# Altium schematic sheet blinkenbytes_sch_altium design.schdoc
size 561 x 373 mm
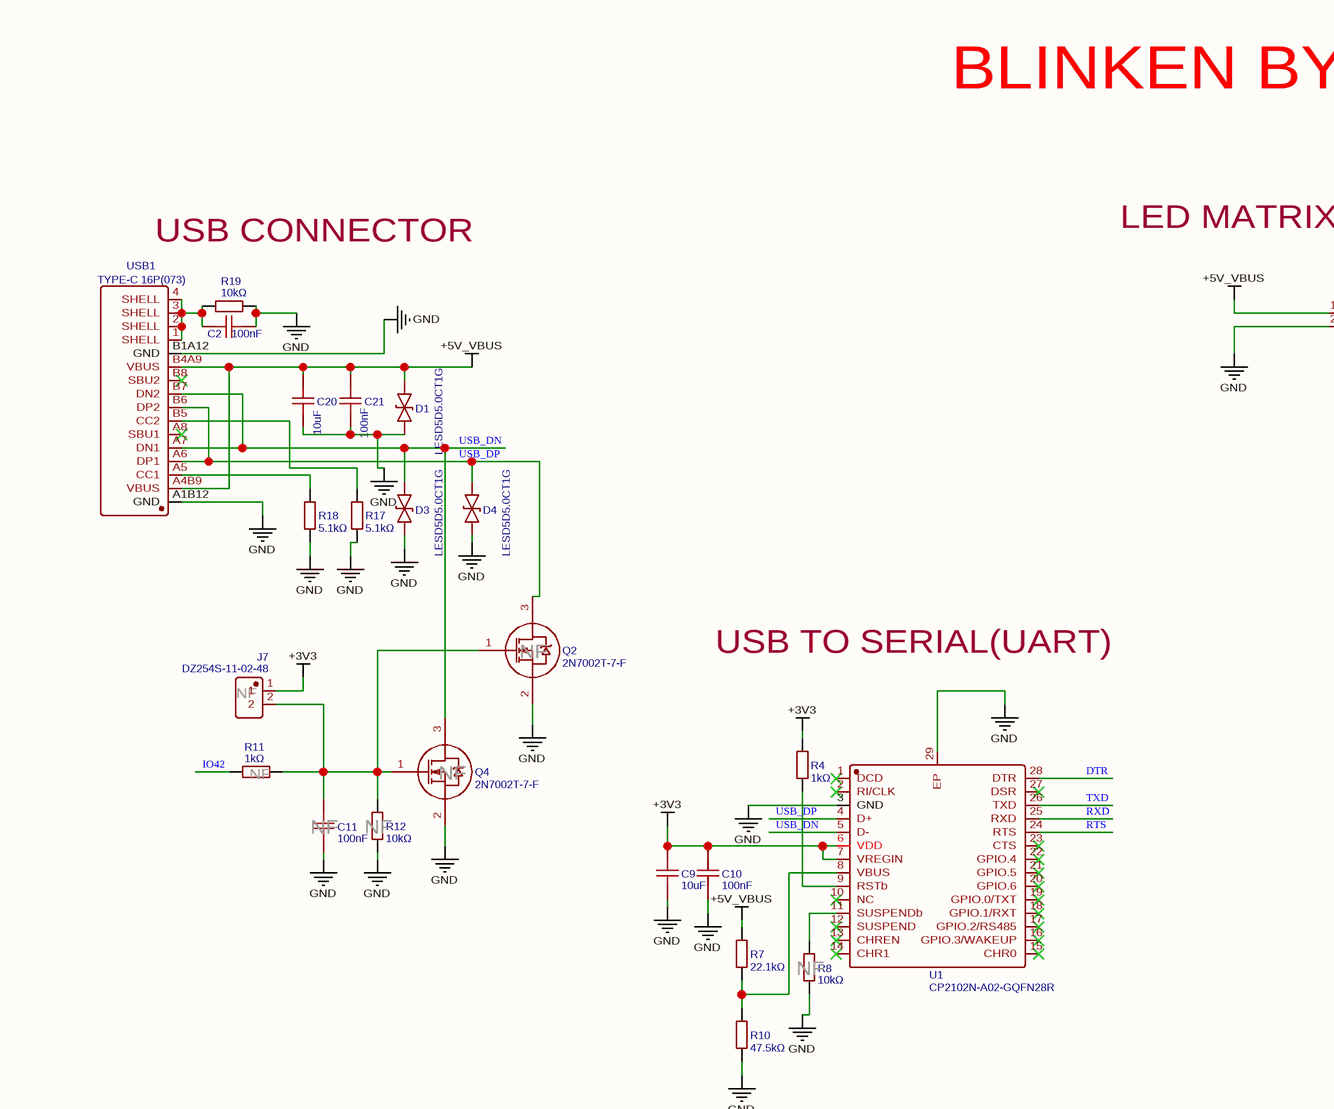
[diagram p0: blinkenbytes_sch_altium design.schdoc, top left]
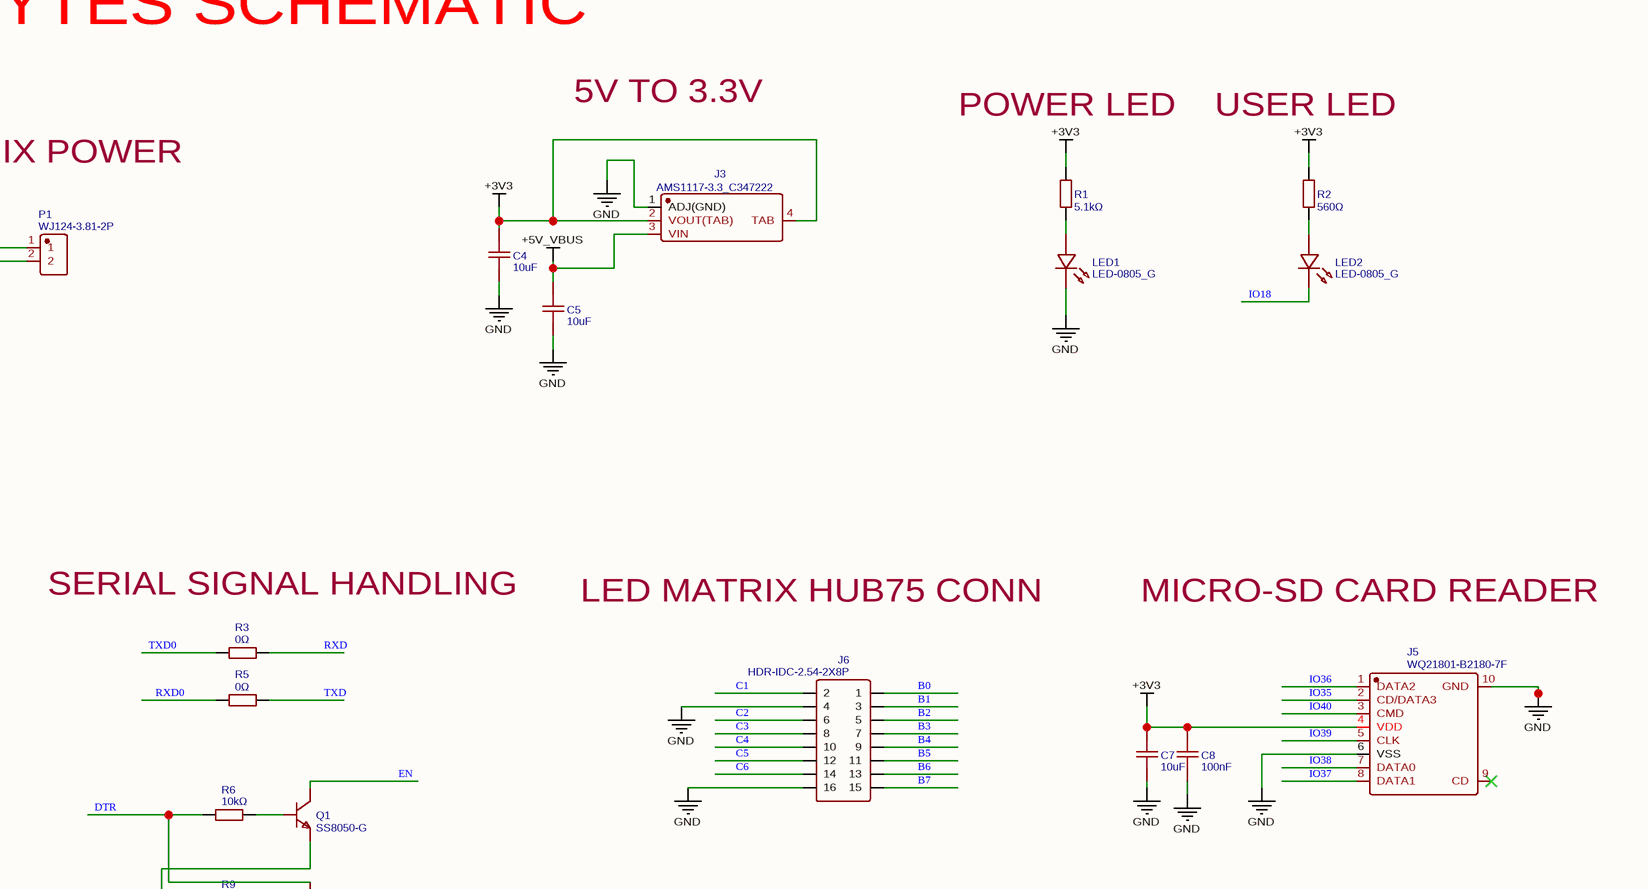
[diagram p1: blinkenbytes_sch_altium design.schdoc, top right]
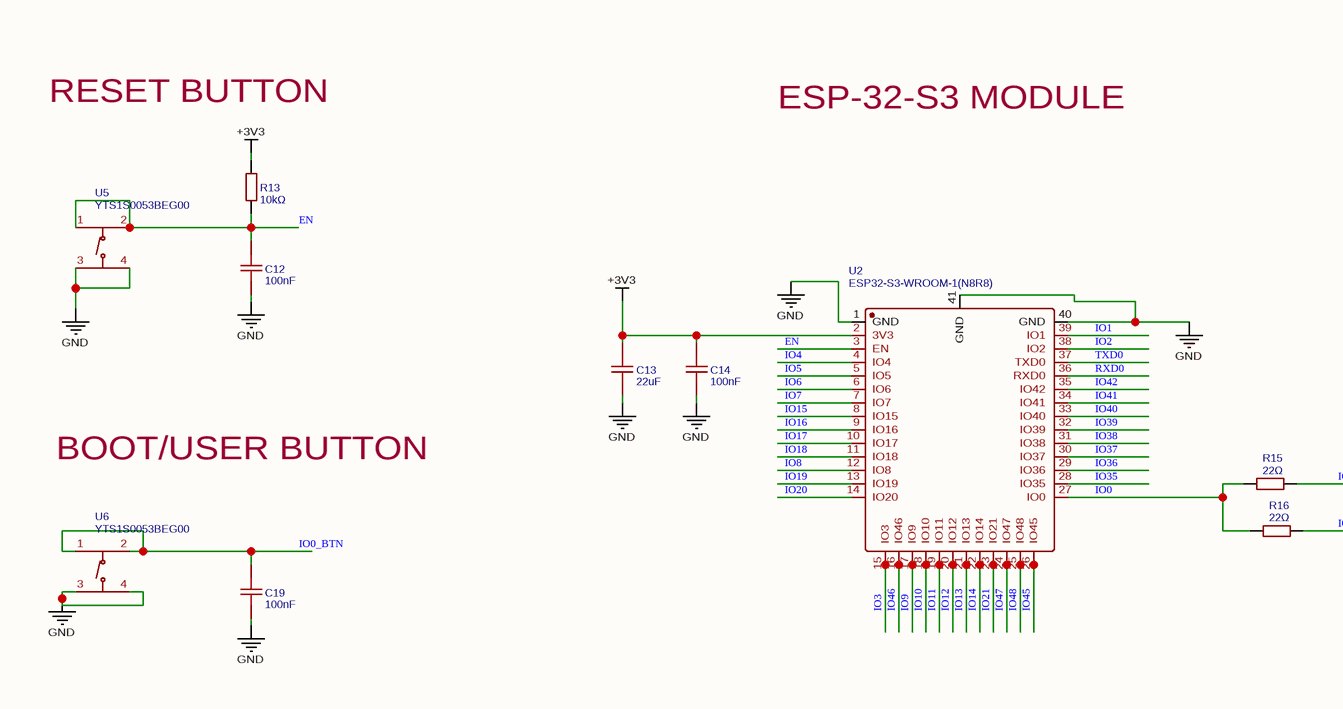
[diagram p2: blinkenbytes_sch_altium design.schdoc, bottom left]
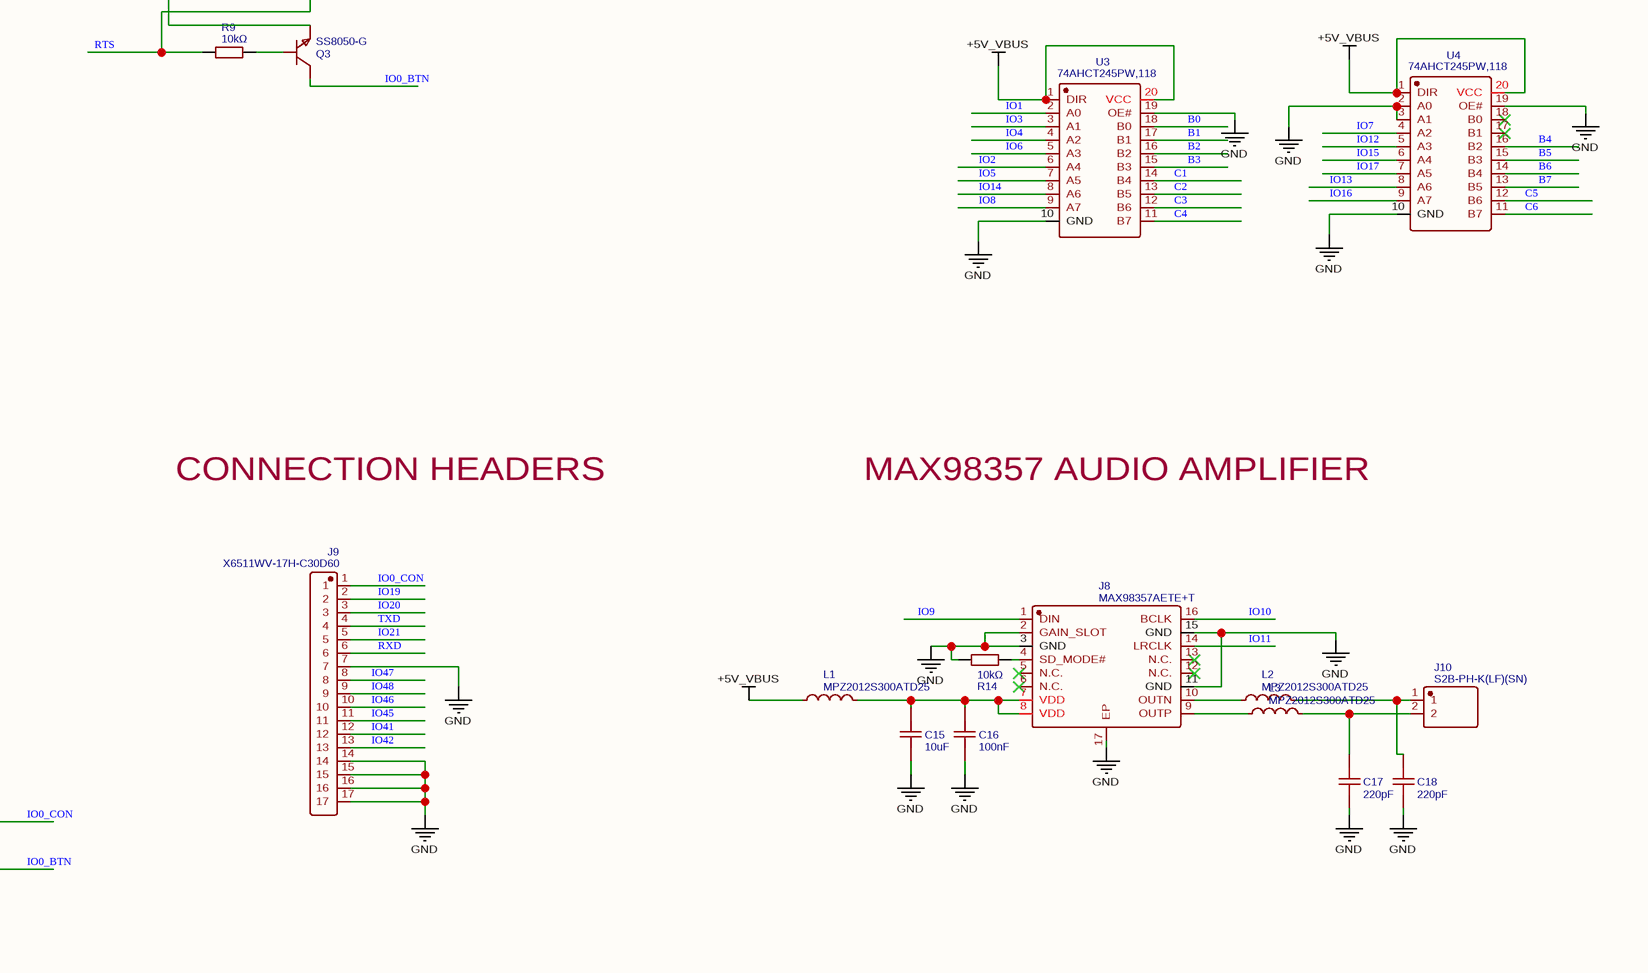
[diagram p3: blinkenbytes_sch_altium design.schdoc, bottom right]

## Parts
C2  100nF  [C0805]
C4  10uF  [C0402]
C5  10uF  [C0402]
C7  10uF  [C0402]
C8  100nF  [C0402]
C9  10uF  [C0402]
C10  100nF  [C0402]
C11  100nF  [C0402]
C12  100nF  [C0402]
C13  22uF  [C0805]
C14  100nF  [C0402]
C15  10uF  [C0805]
C16  100nF  [C0805]
C17  220pF  [C0402]
C18  220pF  [C0402]
C19  100nF  [C0402]
C20  10uF  [C0805]
C21  100nF  [C0805]
D1  LESD5D5.0CT1G  [SOD-523_L1.2-W0.8-LS1.6-BI]
D3  LESD5D5.0CT1G  [SOD-523_L1.2-W0.8-LS1.6-BI]
D4  LESD5D5.0CT1G  [SOD-523_L1.2-W0.8-LS1.6-BI]
J3  AMS1117-3.3_C347222  [SOT-223-4_L6.5-W3.5-P2.30-LS7.0-BR]
J5  WQ21801-B2180-7F  [TF-SMD_WQ21801-B2180-7F]
J6  HDR-IDC-2.54-2X8P  [IDC-TH_16P-P2.54_C3406]
J7  DZ254S-11-02-48  [HDR-SMD_2P-P2.54_XKB_X6511WVS-02H-C60D48R2]
J8  MAX98357AETE+T  [TQFN-16_L3.0-W3.0-P0.50-BL-EP1.5]
J9  X6511WV-17H-C30D60  [HDR-TH_17P-P2.54-V-M]
J10  S2B-PH-K(LF)(SN)  [CONN-TH_S2B-PH-K-LF-SN]
L1  MPZ2012S300ATD25  [L0805]
L2  MPZ2012S300ATD25  [L0805]
L3  MPZ2012S300ATD25  [L0805]
LED1  LED-0805_G  [LED0805_GREEN]
LED2  LED-0805_G  [LED0805_GREEN]
P1  WJ124-3.81-2P  [CONN-TH_2P-P3.81_KF124-3.81-2P]
Q1  SS8050-G  [SOT-23-3_L2.9-W1.3-P1.90-LS2.4-BR]
Q2  2N7002T-7-F  [SOT-523-3_L1.6-W0.8-P1.00-LS1.6-BR]
Q3  SS8050-G  [SOT-23-3_L2.9-W1.3-P1.90-LS2.4-BR]
Q4  2N7002T-7-F  [SOT-523-3_L1.6-W0.8-P1.00-LS1.6-BR]
R1  5.1kΩ  [R0402]
R2  560Ω  [R0402]
R3  0Ω  [R0402]
R4  1kΩ  [R0402]
R5  0Ω  [R0402]
R6  10kΩ  [R0402]
R7  22.1kΩ  [R0402]
R8  10kΩ  [R0402]
R9  10kΩ  [R0402]
R10  47.5kΩ  [R0402]
R11  1kΩ  [R0402]
R12  10kΩ  [R0402]
R13  10kΩ  [R0402]
R14  10kΩ  [R0402]
R15  22Ω  [R0402]
R16  22Ω  [R0402]
R17  5.1kΩ  [R0402]
R18  5.1kΩ  [R0402]
R19  10kΩ  [R0603]
U1  CP2102N-A02-GQFN28R  [QFN-28_L5.0-W5.0-P0.50-TL-EP3.3]
U2  ESP32-S3-WROOM-1(N8R8)  [WIRELM-SMD_ESP32-S3-WROOM-1]
U3  74AHCT245PW,118  [TSSOP-20_L6.5-W4.4-P0.65-LS6.4-BL]
U4  74AHCT245PW,118  [TSSOP-20_L6.5-W4.4-P0.65-LS6.4-BL]
U5  YTS1S0053BEG00  [KEY-SMD_4P-L6.4-W6.3-P4.00-LS9.5]
U6  YTS1S0053BEG00  [KEY-SMD_4P-L6.4-W6.3-P4.00-LS9.5]
USB1  TYPE-C 16P(073)  [USB-C-SMD_TYPE-C16PIN_C668624]

## Nets
+3V3: C4.2 C7.2 C8.2 C9.2 C10.2 C13.2 C14.2 J3.2(VOUT(TAB)) J3.4(TAB) J5.4(VDD) J7.1 R1.2 R2.2 R4.2 R13.2 U1.6(VDD) U1.7(VREGIN) U2.2(3V3)
+5V_VBUS: C5.2 C20.2 C21.2 D1.1 J3.3(VIN) L1.1 P1.1 R7.2 U3.1(DIR) U3.20(VCC) U4.1(DIR) U4.20(VCC) USB1.A4B9(VBUS) USB1.B4A9(VBUS)
GND: C2.2 C4.1 C5.1 C7.1 C8.1 C9.1 C10.1 C11.1 C12.1 C13.1 C14.1 C15.1 C16.1 C17.1 C18.1 C19.1 C20.1 C21.1 D1.2 D3.2 D4.2 J3.1(ADJ(GND)) J5.6(VSS) J5.10(GND) J6.4 J6.16 J8.2(GAIN_SLOT) J8.3(GND) J8.11(GND) J8.15(GND) J8.17(EP) J9.7 J9.14 J9.15 J9.16 J9.17 LED1.2 P1.2 Q2.2(S) Q4.2(S) R8.2 R10.1 R12.2 R14.1 R17.1 R18.1 R19.2 U1.3(GND) U1.29(EP) U2.1(GND) U2.40(GND) U2.41(GND) U3.10(GND) U3.19(OE#) U4.2(A0) U4.3(A1) U4.10(GND) U4.19(OE#) U5.3(C) U5.4(D) U6.3(C) U6.4(D) USB1.A1B12(GND) USB1.B1A12(GND)
B0: J6.1 U3.18(B0)
B1: J6.3 U3.17(B1)
B2: J6.5 U3.16(B2)
B3: J6.7 U3.15(B3)
B4: J6.9 U4.16(B2)
B5: J6.11 U4.15(B3)
B6: J6.13 U4.14(B4)
B7: J6.15 U4.13(B5)
C1: J6.2 U3.14(B4)
C2: J6.6 U3.13(B5)
C3: J6.8 U3.12(B6)
C4: J6.10 U3.11(B7)
C5: J6.12 U4.12(B6)
C6: J6.14 U4.11(B7)
DTR: Q3.2(E) R6.1 U1.28(DTR)
EN: C12.2 Q1.3(C) R13.1 U2.3(EN) U5.1(A) U5.2(B)
IO0: R15.1 R16.1 U2.27(IO0)
IO0_BTN: C19.2 Q3.3(C) R16.2 U6.1(A) U6.2(B)
IO0_CON: J9.1 R15.2
IO1: U2.39(IO1) U3.2(A0)
IO2: U2.38(IO2) U3.6(A4)
IO3: U2.15(IO3) U3.3(A1)
IO4: U2.4(IO4) U3.4(A2)
IO5: U2.5(IO5) U3.7(A5)
IO6: U2.6(IO6) U3.5(A3)
IO7: U2.7(IO7) U4.4(A2)
IO8: U2.12(IO8) U3.9(A7)
IO9: J8.1(DIN) U2.17(IO9)
IO10: J8.16(BCLK) U2.18(IO10)
IO11: J8.14(LRCLK) U2.19(IO11)
IO12: U2.20(IO12) U4.5(A3)
IO13: U2.21(IO13) U4.8(A6)
IO14: U2.22(IO14) U3.8(A6)
IO15: U2.8(IO15) U4.6(A4)
IO16: U2.9(IO16) U4.9(A7)
IO17: U2.10(IO17) U4.7(A5)
IO18: LED2.2 U2.11(IO18)
IO19: J9.2 U2.13(IO19)
IO20: J9.3 U2.14(IO20)
IO21: J9.5 U2.23(IO21)
IO35: J5.2(CD/DATA3) U2.28(IO35)
IO36: J5.1(DATA2) U2.29(IO36)
IO37: J5.8(DATA1) U2.30(IO37)
IO38: J5.7(DATA0) U2.31(IO38)
IO39: J5.5(CLK) U2.32(IO39)
IO40: J5.3(CMD) U2.33(IO40)
IO41: J9.12 U2.34(IO41)
IO42: J9.13 R11.2 U2.35(IO42)
IO45: J9.11 U2.26(IO45)
IO46: J9.10 U2.16(IO46)
IO47: J9.8 U2.24(IO47)
IO48: J9.9 U2.25(IO48)
RTS: Q1.2(E) R9.1 U1.24(RTS)
RXD: J9.6 R3.2 U1.25(RXD)
RXD0: R5.1 U2.36(RXD0)
TXD: J9.4 R5.2 U1.26(TXD)
TXD0: R3.1 U2.37(TXD0)
USB_DN: D3.1 Q4.3(D) U1.5(D-) USB1.A7(DN1) USB1.B7(DN2)
USB_DP: D4.1 Q2.3(D) U1.4(D+) USB1.A6(DP1) USB1.B6(DP2)
NetC2_1: C2.1 R19.1 USB1.1(SHELL) USB1.2(SHELL) USB1.3(SHELL) USB1.4(SHELL)
NetC11_2: C11.2 J7.2 Q2.1(G) Q4.1(G) R11.1 R12.1
NetC15_2: C15.2 C16.2 J8.7(VDD) J8.8(VDD) L1.2
NetC17_2: C17.2 J10.2 L3.2
NetC18_2: C18.2 J10.1 L2.2
NetJ8_4: J8.4(SD_MODE#) R14.2
NetJ8_9: J8.9(OUTP) L3.1
NetJ8_10: J8.10(OUTN) L2.1
NetLED1_1: LED1.1 R1.1
NetLED2_1: LED2.1 R2.1
NetQ1_1: Q1.1(B) R6.2
NetQ3_1: Q3.1(B) R9.2
NetR4_1: R4.1 U1.9(RSTb)
NetR7_1: R7.1 R10.2 U1.8(VBUS)
NetR8_1: R8.1 U1.11(SUSPENDb)
NetR17_2: R17.2 USB1.B5(CC2)
NetR18_2: R18.2 USB1.A5(CC1)

Not connected (* = marked no-connect by the designer): J5 9(CD)*; J8 5(N.C.)* 6(N.C.)* 12(N.C.)* 13(N.C.)*; U1 1(DCD)* 2(RI/CLK)* 10(NC)* 12(SUSPEND)* 13(CHREN)* 14(CHR1)* 15(CHR0)* 16(GPIO.3/WAKEUP)* 17(GPIO.2/RS485)* 18(GPIO.1/RXT)* 19(GPIO.0/TXT)* 20(GPIO.6)* 21(GPIO.5)* 22(GPIO.4)* 23(CTS)* 27(DSR)*; U4 17(B1)* 18(B0)*; USB1 A8(SBU1)* B8(SBU2)*

## Notes on the sheet
- BLINKEN BYTES SCHEMATIC
- 5V TO 3.3V
- LED MATRIX POWER
- POWER LED
- USER LED
- USB CONNECTOR
- (near J7) NF
- (near Q2) NF
- USB TO SERIAL(UART)
- (near R3) SERIAL SIGNAL HANDLING
- LED MATRIX HUB75 CONN
- MICRO-SD CARD READER
- (near R11) NF
- (near Q4) NF
- (near C11) NF
- (near R12) NF
- (near R8) NF
- RESET BUTTON
- ESP-32-S3 MODULE
- CONNECTION HEADERS
- MAX98357 AUDIO AMPLIFIER
- BOOT/USER BUTTON

## Library data of the parts
C2 C16 C21 = 100nF: Manufacturer: SAMSUNG(三星); Manufacturer Part: CL21B104KBFWPJE; nameAlias: Value; Contributor: lcsc; Supplier: LCSC; Supplier Part: C6766050; JLCPCB Part Class: Extended Part; spicePre: C; spiceSymbolName: CL21B104KBFWPJE
C4 C5 C7 C9 = 10uF: Manufacturer: SAMSUNG(三星); Manufacturer Part: CL05A106MP5NUNC; nameAlias: Value; Contributor: LCSC; Supplier: LCSC; Supplier Part: C315248; JLCPCB Part Class: Extended Part; spicePre: C; spiceSymbolName: CL05A106MP5NUNC_C315248
C8 C10-C12 C14 C19 = 100nF: Manufacturer Part: CL05B104KO5NNNC; Manufacturer: SAMSUNG(三星); nameAlias: Value; Supplier: LCSC; Supplier Part: C1525; JLCPCB Part Class: Basic Part; spicePre: C; spiceSymbolName: CL05B104KO5NNNC
C13 = 22uF: Manufacturer: SAMSUNG(三星); Manufacturer Part: CL21A226MAQNNNE; nameAlias: Value; Supplier: LCSC; Supplier Part: C45783; JLCPCB Part Class: Basic Part; spicePre: C; spiceSymbolName: CL21A226MAQNNNE
C15 C20 = 10uF: Manufacturer: SAMSUNG(三星); Manufacturer Part: CL21B106KAYQNNE; nameAlias: Value; Contributor: lcsc; Supplier: LCSC; Supplier Part: C3039694; JLCPCB Part Class: Extended Part; spicePre: C; spiceSymbolName: CL21B106KAYQNNE
C17 C18 = 220pF: Manufacturer: Kyocera AVX; Manufacturer Part: 04025A221JAT2A; nameAlias: Value; Contributor: LCSC; Supplier: LCSC; Supplier Part: C597026; JLCPCB Part Class: Extended Part; spicePre: C; spiceSymbolName: 04025A221JAT2A
D1 D3 D4 = LESD5D5.0CT1G: Manufacturer: LRC(乐山无线电); Contributor: LCSC; Supplier: LCSC; Supplier Part: C383211; Manufacturer Part: LESD5D5.0CT1G; JLCPCB Part Class: Extended Part; spicePre: D; spiceSymbolName: LESD5D5.0CT1G
J3 = AMS1117-3.3_C347222: Manufacturer: UMW(友台半导体); Contributor: LCSC; Supplier: LCSC; Supplier Part: C347222; Manufacturer Part: AMS1117-3.3; JLCPCB Part Class: Extended Part; spicePre: U; spiceSymbolName: AMS1117-3.3_C347222
J5 = WQ21801-B2180-7F: Manufacturer: FOXCONN(富士康); Contributor: LCSC; Supplier: LCSC; Supplier Part: C2836427; Manufacturer Part: WQ21801-B2180-7F; spicePre: C; spiceSymbolName: WQ21801-B2180-7F
J6 = HDR-IDC-2.54-2X8P: Manufacturer: BOOMELE(博穆精密); Manufacturer Part: 2.54-2*8P简牛; Supplier: LCSC; Supplier Part: C3406; JLCPCB Part Class: Extended Part; spicePre: P; spiceSymbolName: HDR-IDC-2.54-2X8P
J7 = DZ254S-11-02-48: Manufacturer: DEALON(德艺隆); Contributor: lcsc; Supplier: LCSC; Supplier Part: C5160785; Manufacturer Part: DZ254S-11-02-48; JLCPCB Part Class: Extended Part; spicePre: C; spiceSymbolName: DZ254S-11-02-48
J8 = MAX98357AETE+T: Manufacturer: ADI(亚德诺)/MAXIM(美信); Contributor: LCSC; Supplier: LCSC; Supplier Part: C910544; Manufacturer Part: MAX98357AETE+T; JLCPCB Part Class: Extended Part; spicePre: U; spiceSymbolName: MAX98357AETE+T
J9 = X6511WV-17H-C30D60: Manufacturer: XKB Connection(中国星坤); Manufacturer Part: X6511WV-17H-C60D30; Contributor: LCSC; Supplier: LCSC; Supplier Part: C725949; JLCPCB Part Class: Extended Part; spicePre: H; spiceSymbolName: X6511WV-17H-C30D60
J10 = S2B-PH-K(LF)(SN): Manufacturer: JST; Contributor: LCSC; Supplier: LCSC; Supplier Part: C265016; Manufacturer Part: S2B-PH-K(LF)(SN); JLCPCB Part Class: Extended Part; spicePre: U; spiceSymbolName: S2B-PH-K(LF)(SN)
L1-L3 = MPZ2012S300ATD25: Manufacturer: TDK; Contributor: LCSC; Supplier: LCSC; Supplier Part: C307779; Manufacturer Part: MPZ2012S300ATD25; JLCPCB Part Class: Extended Part; spicePre: L; spiceSymbolName: MPZ2012S300ATD25
LED1 LED2 = LED-0805_G: Manufacturer: 国星光电; Manufacturer Part: NCD0805G1; Contributor: LCEDA_Lib; Supplier Part: C84260; spicePre: L; spiceSymbolName: LED-0805_G
P1 = WJ124-3.81-2P: Manufacturer: KANGNEX(康奈克斯电气); Supplier: LCSC; Manufacturer Part: WJ124-3.81-2P; Supplier Part: C69811; spicePre: P; spiceSymbolName: WJ124-3.81-2P
Q1 Q3 = SS8050-G: Manufacturer: CJ(江苏长电/长晶); Manufacturer Part: SS8050-G(RANGE:120-200); Contributor: LCSC; Supplier: LCSC; Supplier Part: C164886; JLCPCB Part Class: Extended Part; spicePre: Q; spiceSymbolName: SS8050-G
Q2 Q4 = 2N7002T-7-F: Manufacturer: DIODES(美台); Contributor: LCSC; Supplier: LCSC; Manufacturer Part: 2N7002T-7-F; Supplier Part: C139445; JLCPCB Part Class: Extended Part; spicePre: Q; spiceSymbolName: 2N7002T-7-F
R1 R17 R18 = 5.1kΩ: Manufacturer: UNI-ROYAL(厚声); Manufacturer Part: 0402WGF5101TCE; nameAlias: Value; Supplier: LCSC; Supplier Part: C25905; JLCPCB Part Class: Basic Part; spicePre: R; spiceSymbolName: 0402WGF5101TCE
R2 = 560Ω: Manufacturer: UNI-ROYAL(厚声); Manufacturer Part: 0402WGF5600TCE; nameAlias: Value; Supplier: LCSC; Supplier Part: C25126; JLCPCB Part Class: Extended Part; spicePre: R; spiceSymbolName: 0402WGF5600TCE
R3 R5 = 0Ω: Manufacturer: UNI-ROYAL(厚声); Manufacturer Part: 0402WGF0000TCE; nameAlias: Value; Supplier: LCSC; Supplier Part: C17168; JLCPCB Part Class: Basic Part; spicePre: R; spiceSymbolName: 0402WGF0000TCE
R4 R11 = 1kΩ: Manufacturer: UNI-ROYAL(厚声); Manufacturer Part: 0402WGF1001TCE; nameAlias: Value; Supplier: LCSC; Supplier Part: C11702; JLCPCB Part Class: Basic Part; spicePre: R; spiceSymbolName: 0402WGF1001TCE
R6 R8 R9 R12-R14 = 10kΩ: Manufacturer: UNI-ROYAL(厚声); Manufacturer Part: 0402WGF1002TCE; nameAlias: Value; Supplier: LCSC; Supplier Part: C25744; spicePre: R; spiceSymbolName: 0402WGF1002TCE
  R8 R12 R13: JLCPCB Part Class: Basic Part
R7 = 22.1kΩ: Manufacturer: UNI-ROYAL(厚声); Manufacturer Part: 0402WGF2212TCE; nameAlias: Value; Supplier: LCSC; Supplier Part: C43473; JLCPCB Part Class: Extended Part; spicePre: R; spiceSymbolName: 0402WGF2212TCE
R10 = 47.5kΩ: Manufacturer: UNI-ROYAL(厚声); Manufacturer Part: 0402WGF4752TCE; nameAlias: Value; Supplier: LCSC; Supplier Part: C25896; JLCPCB Part Class: Extended Part; spicePre: R; spiceSymbolName: 0402WGF4752TCE
R15 R16 = 22Ω: Manufacturer: UNI-ROYAL(厚声); Manufacturer Part: 0402WGF220JTCE; nameAlias: Value; Supplier: LCSC; Supplier Part: C25092; JLCPCB Part Class: Basic Part; spicePre: R; spiceSymbolName: 0402WGF220JTCE
R19 = 10kΩ: Manufacturer: UNI-ROYAL(厚声); Manufacturer Part: 0603WAF1002T5E; nameAlias: Value; Supplier: LCSC; Supplier Part: C25804; JLCPCB Part Class: Basic Part; spicePre: R; spiceSymbolName: 0603WAF1002T5E
U1 = CP2102N-A02-GQFN28R: Manufacturer: SKYWORKS/SILICON LABS(芯科); Contributor: LCSC; Supplier: LCSC; Supplier Part: C964632; Manufacturer Part: CP2102N-A02-GQFN28R; JLCPCB Part Class: Extended Part; spicePre: U; spiceSymbolName: CP2102N-A02-GQFN28R
U2 = ESP32-S3-WROOM-1(N8R8): Manufacturer: ESPRESSIF(乐鑫); Manufacturer Part: ESP32-S3-WROOM-1-N8R8; Contributor: LCSC; Supplier: LCSC; Supplier Part: C2913201; JLCPCB Part Class: Extended Part; spicePre: U; spiceSymbolName: ESP32-S3-WROOM-1(N8R8)
U3 U4 = 74AHCT245PW,118: Manufacturer: Nexperia(安世); Contributor: LCSC; Supplier: LCSC; Manufacturer Part: 74AHCT245PW,118; Supplier Part: C173388; JLCPCB Part Class: Extended Part; spicePre: U; spiceSymbolName: 74AHCT245PW,118
U5 U6 = YTS1S0053BEG00: Manufacturer: YIYUAN(怡远); Contributor: lcsc; Supplier: LCSC; Supplier Part: C5188563; Manufacturer Part: YTS1S0053BEG00; JLCPCB Part Class: Extended Part; spicePre: U; spiceSymbolName: YTS1S0053BEG00
USB1 = TYPE-C 16P(073): Manufacturer: SHOU HAN(首韩); Contributor: LCSC; Supplier: LCSC; Supplier Part: C668624; Manufacturer Part: TYPE-C 16P(073); JLCPCB Part Class: Extended Part; spicePre: U; spiceSymbolName: TYPE-C 16P(073)